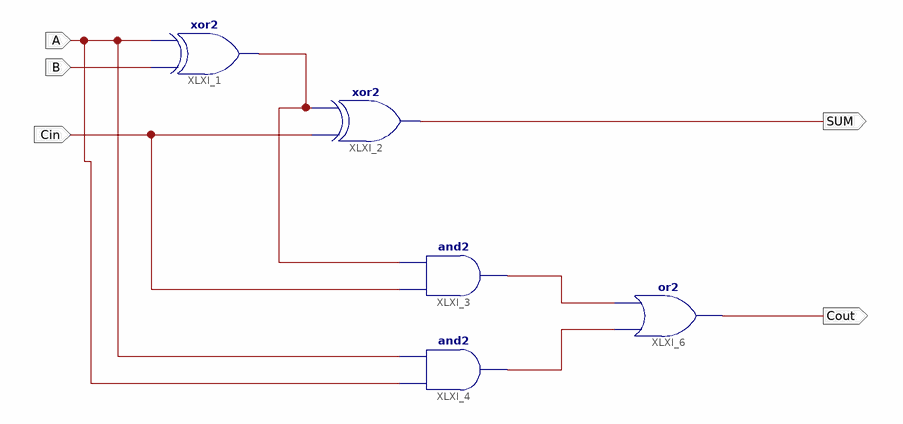
[diagram p0: schematic sheet 1]
// Xilinx ISE schematic full_adder_sch.sch (spartan6) as structural Verilog: 5 symbols, 5 ports
module full_adder_sch (
  input  B,
  input  A,
  input  Cin,
  output Cout,
  output SUM
);

  wire XLXN_10, XLXN_11, XLXN_12;

  xor XLXI_1 (XLXN_10, B, A);
  xor XLXI_2 (SUM, Cin, XLXN_10);
  and XLXI_3 (XLXN_11, Cin, XLXN_10);
  and XLXI_4 (XLXN_12, A, A);
  or XLXI_6 (Cout, XLXN_12, XLXN_11);
endmodule
